# EAGLE design miniB (EAGLE 6.3)
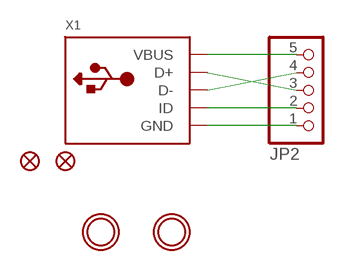
[diagram p0: schematic, sheet 1]

## Parts
FID1  FIDUCIAL""  [FIDUCIAL_1MM]
FID2  FIDUCIAL""  [FIDUCIAL_1MM]
JP2  HEADER-1X570MIL  [1X05_ROUND_70]
U$1  MOUNTINGHOLE2.5  [MOUNTINGHOLE_2.5_PLATED]
U$2  MOUNTINGHOLE2.5  [MOUNTINGHOLE_2.5_PLATED]
X1  USBMINIBLARGE  [USB-MINIB_LARGER]

## Nets
D+: JP2.3 X1.D+
D-: JP2.4 X1.D-
GND: JP2.1 X1.GND X1.GND1(GND) X1.GND2(GND) X1.GND3(GND) X1.GND4(GND)
ID: JP2.2 X1.ID
VBUS: JP2.5 X1.VBUS

## Library data of the parts
FID1 FID2 = microbuilder:FIDUCIAL: Fiducial Alignment Points Various fiducial points for machine vision alignment.; BOM: EXCLUDE
JP2 = microbuilder:HEADER-1X5: PIN HEADER
U$1 U$2 = microbuilder:MOUNTINGHOLE: Mounting Hole For #2 screws (0.086"/2.18mm width, 0.094"/2.4mm hole) use 2.5mm; BOM: EXCLUDE
X1 = microbuilder:USB: USB Connectors USBMINIB - Surface Mount Female Mini-B USB Connector 4UConnector: 06564

## Board
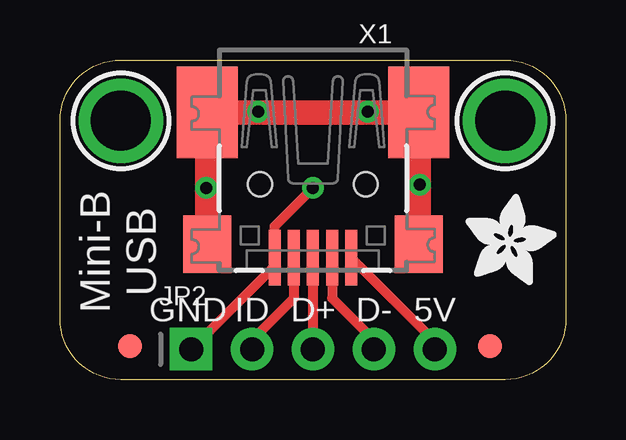
[diagram p1: board, top side]
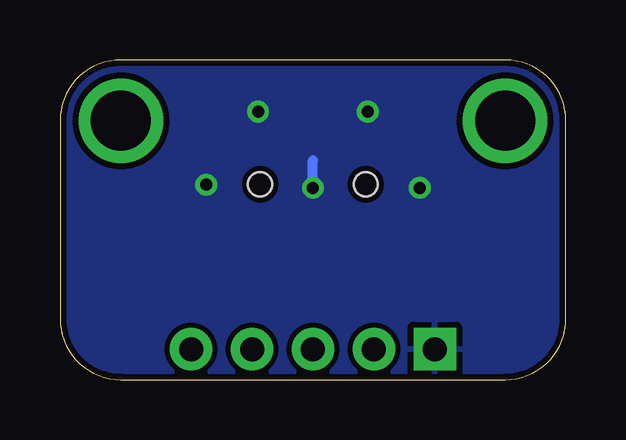
[diagram p2: board, bottom side, seen from below]

Size 21.08 x 13.34 mm. Coordinates in mm from the lower left corner, seen from the top.
Outline: 2.54,13.34 18.54,13.34 arc-90 21.08,10.79 21.08,2.54 arc-90 18.54,0 2.54,0 arc-90 0,2.54 0,10.79 arc-90 2.54,13.34
Copper layers (1*16): Top 0.035mm / dielectric 1.5mm / Bottom 0.035mm
Design rules "default": minimum track width 10mil, minimum drill 16mil, track to track 8mil, track to pad 8mil, pad to pad 8mil, via to via 8mil, smd to smd 8mil, copper to edge 10mil, drill to drill 8mil, minimum pad ring 10mil, minimum via ring 8mil, stop-mask expansion 4mil, vias tented up to drill 20mil, thermal gap 10mil

### Footprints (pad centres in the part's own frame; a part is rotated, then mirrored left to right if it is on the bottom)
FIDUCIAL_1MM = smd 1 x 1: 1 0,0
1X05_ROUND_70 = drill 1 pad 1.778 square: 1 -5.08,0 | drill 1 pad 1.778: 2 -2.54,0; 3 0,0; 4 2.54,0; 5 5.08,0
MOUNTINGHOLE_2.5_PLATED = drill 2.5 pad 3.2: P$1 0,0
USB-MINIB_LARGER = smd 0.5 x 2.308: D+ 0,4.064; D- -0.8,4.064; GND 1.6,4.064; ID 0.8,4.064; VBUS -1.6,4.064 | smd 2.54 x 3.81: GND1 -4.4,-2; GND4 4.4,-2 | smd 2 x 2.4: GND2 -4.4,3.5; GND3 4.4,3.5 | hole 1: -2.2,1; 2.2,1

### Placement (x,y rotation side)
FID1  2.92,1.4 0 top
FID2  17.91,1.4 0 top
JP2  10.54,1.27 0 top
U$1  2.54,10.79 0 top
U$2  18.54,10.79 0 top
U$4  [ADAFRUIT_3.5MM]  16.89,3.94 0 top
X1  10.54,9.14 180 top

### Tracks (layer width: path | path; a pad name or v marks a point on that pad's centre or on a via)
D+
  Top 0.406: X1.D+ JP2.3
D-
  Top 0.406: X1.D- 11.34,3.39 13.08,1.65 JP2.4
GND  (via drill 0.5)
  Top 0.406: JP2.1 8.94,4.75 X1.GND 8.94,6.4 v10.54,8 | X1.GND4 6.17,11.18 v8.26,11.18
  Top 1.016: X1.GND3 X1.GND4 X1.GND1 X1.GND2
  Bottom 0.406: v10.54,8 10.54,9.14
  other vias: 12.83,11.18 6.1,8 14.99,8.13
  pour Bottom: 0,13.34 0,0 21.21,0 21.21,13.34
ID
  Top 0.406: X1.ID 9.74,3.39 8.13,1.78 8.13,1.4 JP2.2
VBUS
  Top 0.406: X1.VBUS 15.62,1.6 JP2.5

### Text on the board
tPlace: Mini-B / USB | GND | ID | D+ | D- | 5V